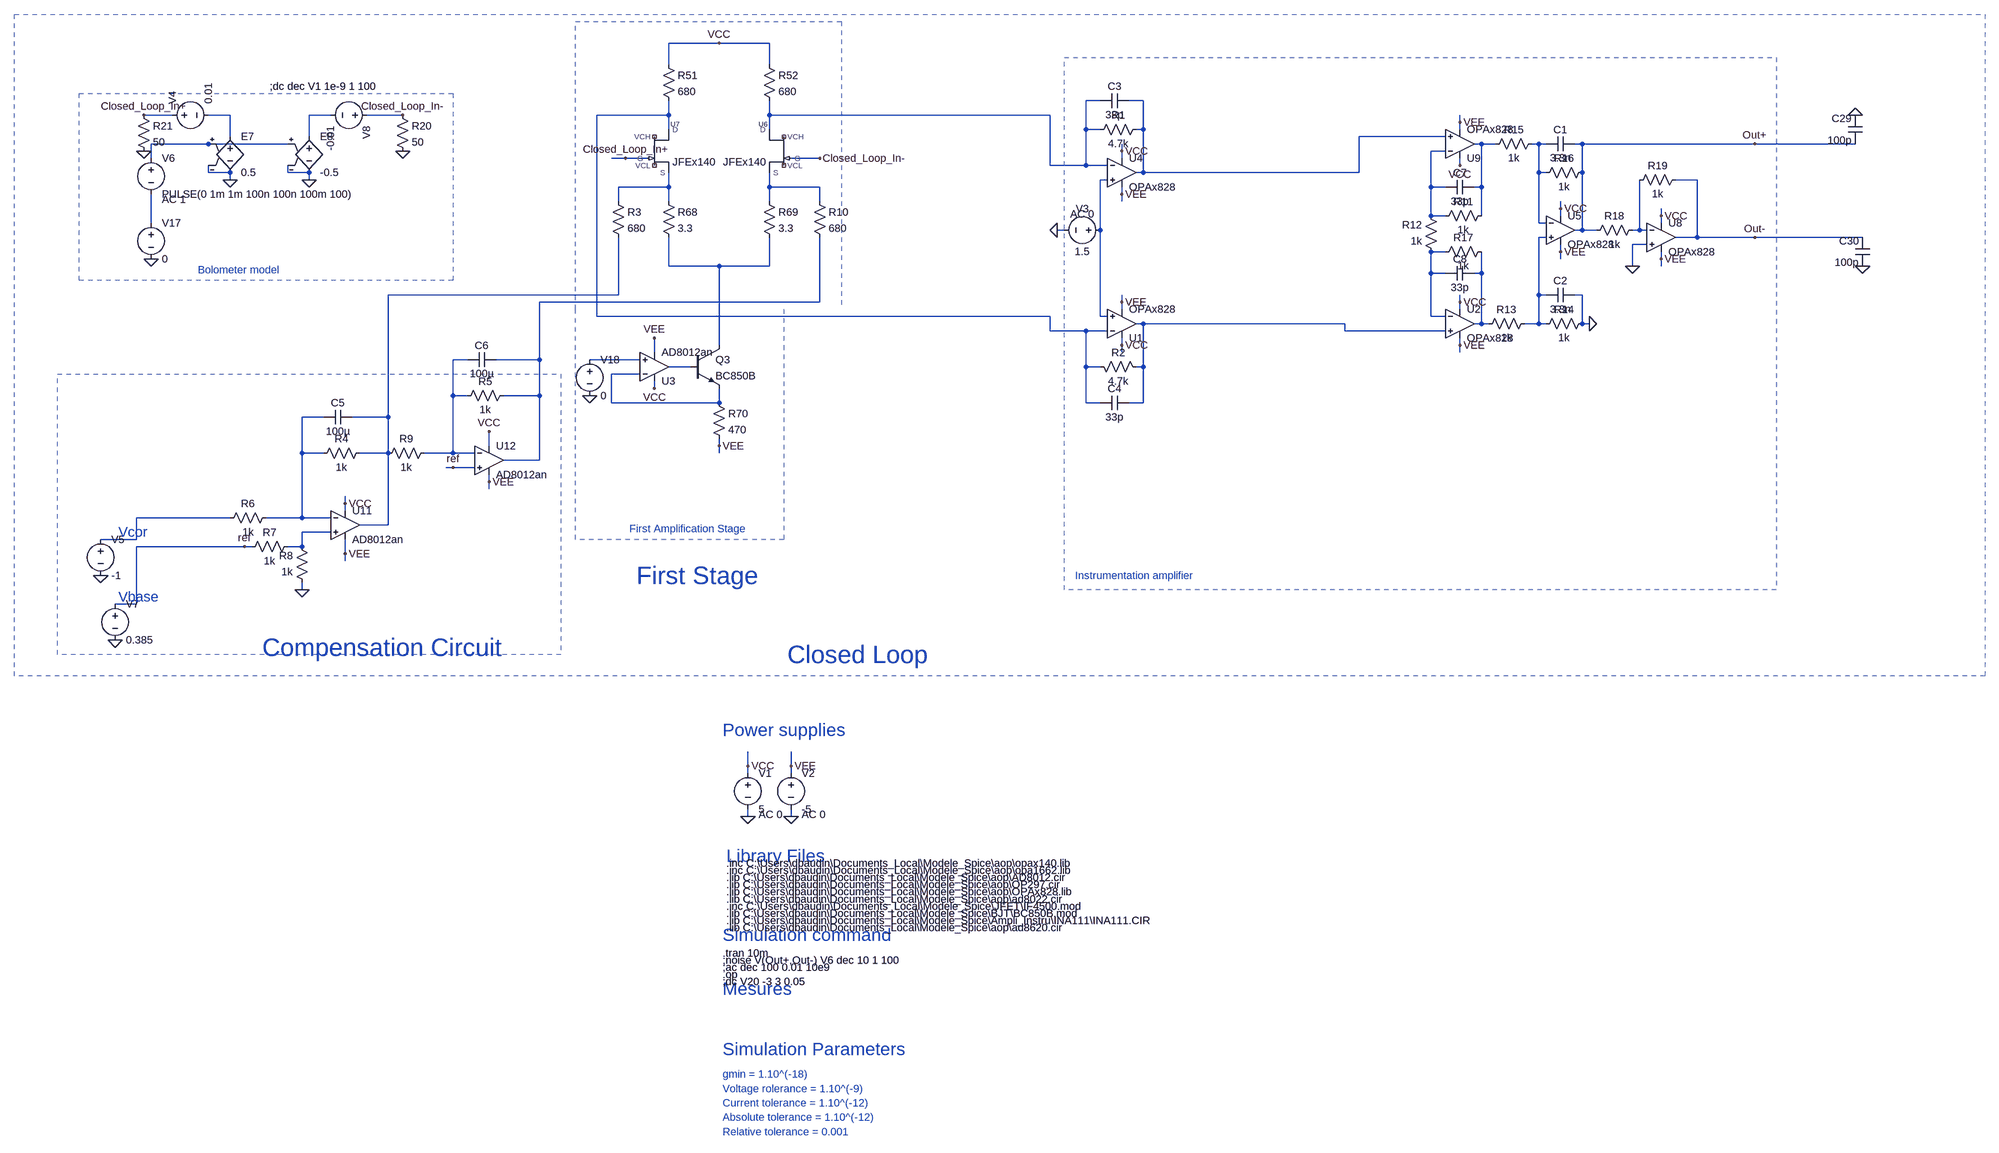
[diagram p0: schematic Board_V3.asc]
Board_V3.asc, the LTspice schematic file:
Version 4
SHEET 1 9396 1576
WIRE -496 -1472 -608 -1472
WIRE -384 -1472 -496 -1472
WIRE -608 -1424 -608 -1472
WIRE -384 -1424 -384 -1472
WIRE 352 -1344 320 -1344
WIRE 448 -1344 416 -1344
WIRE -1712 -1312 -1776 -1312
WIRE -1584 -1312 -1632 -1312
WIRE -1360 -1312 -1408 -1312
WIRE -1200 -1312 -1280 -1312
WIRE -608 -1312 -608 -1344
WIRE -608 -1312 -768 -1312
WIRE -384 -1312 -384 -1344
WIRE 240 -1312 -384 -1312
WIRE 1152 -1296 1152 -1312
WIRE -608 -1280 -608 -1312
WIRE -384 -1280 -384 -1312
WIRE 320 -1280 320 -1344
WIRE 352 -1280 320 -1280
WIRE 448 -1280 448 -1344
WIRE 448 -1280 432 -1280
WIRE 1152 -1280 1152 -1296
WIRE -1584 -1264 -1584 -1312
WIRE -1408 -1264 -1408 -1312
WIRE 1120 -1264 928 -1264
WIRE -1632 -1248 -1760 -1248
WIRE -1456 -1248 -1632 -1248
WIRE 1200 -1248 1184 -1248
WIRE 1232 -1248 1200 -1248
WIRE 1328 -1248 1312 -1248
WIRE 1344 -1248 1328 -1248
WIRE 1424 -1248 1408 -1248
WIRE 1808 -1248 1424 -1248
WIRE 2032 -1248 1808 -1248
WIRE 400 -1232 400 -1248
WIRE 1120 -1232 1088 -1232
WIRE -1760 -1216 -1760 -1248
WIRE -704 -1216 -736 -1216
WIRE -656 -1216 -704 -1216
WIRE -272 -1216 -336 -1216
WIRE 400 -1216 400 -1232
WIRE 240 -1200 240 -1312
WIRE 320 -1200 320 -1280
WIRE 320 -1200 240 -1200
WIRE 368 -1200 320 -1200
WIRE 1152 -1200 1152 -1216
WIRE -1632 -1184 -1632 -1200
WIRE -1584 -1184 -1632 -1184
WIRE -1456 -1184 -1456 -1200
WIRE -1408 -1184 -1456 -1184
WIRE 448 -1184 448 -1280
WIRE 448 -1184 432 -1184
WIRE 928 -1184 928 -1264
WIRE 928 -1184 448 -1184
WIRE 1328 -1184 1328 -1248
WIRE 1344 -1184 1328 -1184
WIRE 1424 -1184 1424 -1248
WIRE -1584 -1168 -1584 -1184
WIRE -1408 -1168 -1408 -1184
WIRE 368 -1168 352 -1168
WIRE 1680 -1168 1632 -1168
WIRE -608 -1152 -608 -1184
WIRE -608 -1152 -720 -1152
WIRE -384 -1152 -384 -1184
WIRE -272 -1152 -384 -1152
WIRE 1088 -1152 1088 -1232
WIRE 1120 -1152 1088 -1152
WIRE 1200 -1152 1200 -1248
WIRE 1200 -1152 1184 -1152
WIRE 400 -1136 400 -1152
WIRE -720 -1120 -720 -1152
WIRE -608 -1120 -608 -1152
WIRE -384 -1120 -384 -1152
WIRE -272 -1120 -272 -1152
WIRE 400 -1120 400 -1136
WIRE 1376 -1104 1376 -1120
WIRE 1088 -1088 1088 -1152
WIRE 1120 -1088 1088 -1088
WIRE 1200 -1088 1200 -1152
WIRE 1376 -1088 1376 -1104
WIRE 1600 -1088 1600 -1104
WIRE -1760 -1072 -1760 -1136
WIRE 1328 -1072 1328 -1184
WIRE 1344 -1072 1328 -1072
WIRE 1600 -1072 1600 -1088
WIRE 272 -1056 256 -1056
WIRE 352 -1056 352 -1168
WIRE 1424 -1056 1424 -1184
WIRE 1424 -1056 1408 -1056
WIRE 1456 -1056 1424 -1056
WIRE 1552 -1056 1552 -1168
WIRE 1552 -1056 1536 -1056
WIRE 1568 -1056 1552 -1056
WIRE 1344 -1040 1328 -1040
WIRE 1680 -1040 1680 -1168
WIRE 1680 -1040 1632 -1040
WIRE 1808 -1040 1680 -1040
WIRE 2048 -1040 1808 -1040
WIRE 1568 -1024 1536 -1024
WIRE 1120 -1008 1088 -1008
WIRE 1376 -1008 1376 -1024
WIRE 1376 -992 1376 -1008
WIRE 1600 -992 1600 -1008
WIRE -608 -976 -608 -1040
WIRE -496 -976 -608 -976
WIRE -384 -976 -384 -1040
WIRE -384 -976 -496 -976
WIRE 1536 -976 1536 -1024
WIRE 1600 -976 1600 -992
WIRE 1088 -960 1088 -1008
WIRE 1120 -960 1088 -960
WIRE 1200 -960 1200 -1008
WIRE 1200 -960 1184 -960
WIRE -720 -912 -720 -1040
WIRE -720 -912 -1232 -912
WIRE 1328 -912 1328 -1040
WIRE 1344 -912 1328 -912
WIRE 1424 -912 1408 -912
WIRE -272 -896 -272 -1040
WIRE -272 -896 -896 -896
WIRE 400 -896 400 -912
WIRE 1152 -896 1152 -912
WIRE 400 -880 400 -896
WIRE 1152 -880 1152 -896
WIRE -768 -864 -768 -1312
WIRE 240 -864 -768 -864
WIRE 352 -864 352 -1056
WIRE 368 -864 352 -864
WIRE 1088 -864 1088 -960
WIRE 1120 -864 1088 -864
WIRE 448 -848 432 -848
WIRE 896 -848 448 -848
WIRE 1200 -848 1200 -960
WIRE 1200 -848 1184 -848
WIRE 1216 -848 1200 -848
WIRE 1328 -848 1328 -912
WIRE 1328 -848 1296 -848
WIRE 1344 -848 1328 -848
WIRE 1424 -848 1424 -912
WIRE 1440 -848 1424 -848
WIRE 240 -832 240 -864
WIRE 320 -832 240 -832
WIRE 368 -832 320 -832
WIRE 896 -832 896 -848
WIRE 1120 -832 896 -832
WIRE -496 -800 -496 -976
WIRE 400 -800 400 -816
WIRE 1152 -800 1152 -816
WIRE -640 -784 -640 -816
WIRE 400 -784 400 -800
WIRE 1152 -784 1152 -800
WIRE -1056 -768 -1088 -768
WIRE -896 -768 -896 -896
WIRE -896 -768 -992 -768
WIRE -672 -768 -784 -768
WIRE -560 -752 -608 -752
WIRE 320 -752 320 -832
WIRE 352 -752 320 -752
WIRE 448 -752 448 -848
WIRE 448 -752 432 -752
WIRE -672 -736 -736 -736
WIRE -640 -704 -640 -720
WIRE -1088 -688 -1088 -768
WIRE -1056 -688 -1088 -688
WIRE -896 -688 -896 -768
WIRE -896 -688 -976 -688
WIRE -736 -672 -736 -736
WIRE -496 -672 -496 -704
WIRE -496 -672 -736 -672
WIRE 320 -672 320 -752
WIRE 352 -672 320 -672
WIRE 448 -672 448 -752
WIRE 448 -672 416 -672
WIRE -1376 -640 -1424 -640
WIRE -1232 -640 -1232 -912
WIRE -1232 -640 -1312 -640
WIRE -1008 -576 -1008 -608
WIRE -496 -576 -496 -592
WIRE -1424 -560 -1424 -640
WIRE -1376 -560 -1424 -560
WIRE -1232 -560 -1232 -640
WIRE -1232 -560 -1296 -560
WIRE -1088 -560 -1088 -688
WIRE -1088 -560 -1152 -560
WIRE -1040 -560 -1088 -560
WIRE -496 -560 -496 -576
WIRE -896 -544 -896 -688
WIRE -896 -544 -976 -544
WIRE -1088 -528 -1104 -528
WIRE -1040 -528 -1088 -528
WIRE -1008 -496 -1008 -512
WIRE -1008 -480 -1008 -496
WIRE -1328 -448 -1328 -464
WIRE -1328 -432 -1328 -448
WIRE -1584 -416 -1792 -416
WIRE -1424 -416 -1424 -560
WIRE -1424 -416 -1504 -416
WIRE -1360 -416 -1424 -416
WIRE -1232 -400 -1232 -560
WIRE -1232 -400 -1296 -400
WIRE -1360 -384 -1424 -384
WIRE -1792 -368 -1792 -416
WIRE -1792 -368 -1872 -368
WIRE -1552 -352 -1792 -352
WIRE -1536 -352 -1552 -352
WIRE -1424 -352 -1424 -384
WIRE -1424 -352 -1456 -352
WIRE -1328 -336 -1328 -368
WIRE -1328 -320 -1328 -336
WIRE -1424 -256 -1424 -272
WIRE -1792 -224 -1792 -352
WIRE -1792 -224 -1840 -224
WIRE -432 656 -432 624
WIRE -336 656 -336 624
WIRE -432 672 -432 656
WIRE -336 672 -336 656
WIRE -432 768 -432 752
WIRE -336 768 -336 752
FLAG -432 768 0
FLAG -336 768 0
FLAG -432 656 VCC
FLAG -336 656 VEE
FLAG -496 -1472 VCC
FLAG -704 -1216 Closed_Loop_In+
FLAG -272 -1216 Closed_Loop_In-
FLAG -1584 -1168 0
FLAG -1408 -1168 0
FLAG -1776 -1312 Closed_Loop_In+
FLAG -1200 -1312 Closed_Loop_In-
FLAG -1760 -992 0
FLAG -640 -816 VEE
FLAG -640 -704 VCC
FLAG -496 -576 VEE
FLAG -784 -688 0
FLAG 2048 -976 0
FLAG 2032 -1312 0
FLAG 400 -1136 VEE
FLAG 400 -1232 VCC
FLAG 256 -1056 0
FLAG 400 -896 VEE
FLAG 400 -800 VCC
FLAG -1328 -448 VCC
FLAG -1328 -336 VEE
FLAG -1088 -528 ref
FLAG -1424 -256 0
FLAG -1552 -352 ref
FLAG -1008 -608 VCC
FLAG -1008 -496 VEE
FLAG -1872 -288 0
FLAG -1840 -144 0
FLAG 1152 -1200 VCC
FLAG 1152 -1296 VEE
FLAG 1152 -896 VCC
FLAG 1152 -800 VEE
FLAG 1376 -1104 VCC
FLAG 1376 -1008 VEE
FLAG 1440 -848 0
FLAG 1600 -1088 VCC
FLAG 1600 -992 VEE
FLAG 1536 -976 0
FLAG 1808 -1248 Out+
FLAG 1808 -1040 Out-
FLAG -1776 -1232 0
FLAG -1200 -1232 0
DATAFLAG -480 -1472 ""
DATAFLAG -560 -976 ""
DATAFLAG -608 -1152 ""
DATAFLAG -384 -1152 ""
DATAFLAG -688 -1216 ""
DATAFLAG -320 -1216 ""
DATAFLAG -384 -1328 ""
DATAFLAG -608 -1328 ""
DATAFLAG -608 -672 ""
DATAFLAG -576 -752 ""
DATAFLAG 1968 -1040 ""
DATAFLAG 1968 -1248 ""
DATAFLAG 320 -1248 ""
DATAFLAG 320 -784 ""
DATAFLAG 448 -1248 ""
DATAFLAG -912 -688 ""
DATAFLAG -1232 -400 ""
DATAFLAG -1072 -528 ""
DATAFLAG -1136 -560 ""
DATAFLAG -1408 -384 ""
DATAFLAG -1488 -416 ""
DATAFLAG -928 -544 ""
DATAFLAG -1616 -416 ""
DATAFLAG -1568 -352 ""
DATAFLAG 1200 -1200 ""
DATAFLAG 1200 -928 ""
DATAFLAG 1328 -896 ""
DATAFLAG 1328 -1136 ""
DATAFLAG 1824 -1248 ""
DATAFLAG 352 -976 ""
DATAFLAG 400 -1232 ""
DATAFLAG 400 -1136 ""
DATAFLAG 480 -848 ""
DATAFLAG -720 -960 ""
DATAFLAG -272 -960 ""
DATAFLAG -720 -768 ""
DATAFLAG -1216 -1312 ""
DATAFLAG -1728 -1312 ""
SYMBOL voltage -432 656 R0
WINDOW 123 24 108 Left 2
WINDOW 39 0 0 Left 0
SYMATTR Value2 AC 0
SYMATTR InstName V1
SYMATTR Value 5
SYMBOL voltage -336 656 R0
WINDOW 123 24 108 Left 2
WINDOW 39 0 0 Left 0
SYMATTR Value2 AC 0
SYMATTR InstName V2
SYMATTR Value -5
SYMBOL res -624 -1440 R0
SYMATTR InstName R51
SYMATTR Value 680
SYMBOL res -400 -1440 R0
SYMATTR InstName R52
SYMATTR Value 680
SYMBOL res -624 -1136 R0
SYMATTR InstName R68
SYMATTR Value 3.3
SYMBOL res -400 -1136 R0
SYMATTR InstName R69
SYMATTR Value 3.3
SYMBOL voltage -1760 -1232 R0
WINDOW 123 24 108 Left 2
WINDOW 39 0 0 Left 0
SYMATTR Value2 AC 1
SYMATTR InstName V6
SYMATTR Value PULSE(0 1m 1m 100n 100n 100m 100)
SYMBOL e -1584 -1280 R0
SYMATTR InstName E7
SYMATTR Value 0.5
SYMBOL e -1408 -1280 R0
SYMATTR InstName E8
SYMATTR Value -0.5
SYMBOL voltage -1760 -1088 R0
WINDOW 123 0 0 Left 0
WINDOW 39 0 0 Left 0
SYMATTR InstName V17
SYMATTR Value 0
SYMBOL res -512 -688 R0
SYMATTR InstName R70
SYMATTR Value 470
SYMBOL npn -560 -800 R0
SYMATTR InstName Q3
SYMATTR Value BC850B
SYMBOL voltage -784 -784 R0
WINDOW 123 0 0 Left 0
WINDOW 39 0 0 Left 0
SYMATTR InstName V18
SYMATTR Value 0
SYMBOL cap 2048 -1248 R180
WINDOW 0 24 56 Left 2
WINDOW 3 24 8 Left 2
SYMATTR InstName C29
SYMATTR Value 100p
SYMBOL cap 2064 -976 R180
WINDOW 0 24 56 Left 2
WINDOW 3 24 8 Left 2
SYMATTR InstName C30
SYMATTR Value 100p
SYMBOL AutoGenerated\\JFEx140 -656 -1280 R0
SYMATTR InstName U7
SYMBOL AutoGenerated\\JFEx140 -336 -1280 M0
SYMATTR InstName U6
SYMBOL res 448 -1296 R90
WINDOW 0 0 56 VBottom 2
WINDOW 3 32 56 VTop 2
SYMATTR InstName R1
SYMATTR Value 4.7k
SYMBOL voltage 368 -1056 R90
WINDOW 0 -32 56 VBottom 2
WINDOW 3 32 56 VTop 2
WINDOW 123 -20 56 VBottom 2
WINDOW 39 0 0 Left 0
SYMATTR InstName V3
SYMATTR Value 1.5
SYMATTR Value2 AC 0
SYMBOL res 448 -736 M270
WINDOW 0 32 56 VTop 2
WINDOW 3 0 56 VBottom 2
SYMATTR InstName R2
SYMATTR Value 4.7k
SYMBOL cap 416 -1360 R90
WINDOW 0 0 32 VBottom 2
WINDOW 3 32 32 VTop 2
SYMATTR InstName C3
SYMATTR Value 33p
SYMBOL cap 416 -688 R90
WINDOW 0 0 32 VBottom 2
WINDOW 3 32 32 VTop 2
SYMATTR InstName C4
SYMATTR Value 33p
SYMBOL res -1280 -576 R90
WINDOW 0 0 56 VBottom 2
WINDOW 3 32 56 VTop 2
SYMATTR InstName R4
SYMATTR Value 1k
SYMBOL res -960 -704 R90
WINDOW 0 0 56 VBottom 2
WINDOW 3 32 56 VTop 2
SYMATTR InstName R5
SYMATTR Value 1k
SYMBOL res -1488 -432 R90
WINDOW 0 0 56 VBottom 2
WINDOW 3 32 56 VTop 2
SYMATTR InstName R6
SYMATTR Value 1k
SYMBOL res -1440 -368 R90
WINDOW 0 0 56 VBottom 2
WINDOW 3 32 56 VTop 2
SYMATTR InstName R7
SYMATTR Value 1k
SYMBOL res -1408 -256 R180
WINDOW 0 36 76 Left 2
WINDOW 3 36 40 Left 2
SYMATTR InstName R8
SYMATTR Value 1k
SYMBOL res -1136 -576 R90
WINDOW 0 0 56 VBottom 2
WINDOW 3 32 56 VTop 2
SYMATTR InstName R9
SYMATTR Value 1k
SYMBOL voltage -1872 -384 R0
WINDOW 123 0 0 Left 0
WINDOW 39 0 0 Left 0
SYMATTR InstName V5
SYMATTR Value -1
SYMBOL voltage -1840 -240 R0
WINDOW 123 0 0 Left 0
WINDOW 39 0 0 Left 0
SYMATTR InstName V7
SYMATTR Value 0.385
SYMBOL res -736 -1136 R0
SYMATTR InstName R3
SYMATTR Value 680
SYMBOL res -288 -1136 R0
SYMATTR InstName R10
SYMATTR Value 680
SYMBOL AutoGenerated\\AD8012an -640 -752 M180
SYMATTR InstName U3
SYMBOL AutoGenerated\\AD8012an -1328 -400 R0
SYMATTR InstName U11
SYMBOL AutoGenerated\\AD8012an -1008 -544 R0
SYMATTR InstName U12
SYMBOL cap -1312 -656 R90
WINDOW 0 0 32 VBottom 2
WINDOW 3 32 32 VTop 2
SYMATTR InstName C5
SYMATTR Value 100µ
SYMBOL cap -992 -784 R90
WINDOW 0 0 32 VBottom 2
WINDOW 3 32 32 VTop 2
SYMATTR InstName C6
SYMATTR Value 100µ
SYMBOL OpAmps\\opamp2 400 -1248 R0
SYMATTR InstName U4
SYMATTR Value OPAx828
SYMBOL OpAmps\\opamp2 400 -784 M180
SYMATTR InstName U1
SYMATTR Value OPAx828
SYMBOL res 1216 -1104 R90
WINDOW 0 0 56 VBottom 2
WINDOW 3 32 56 VTop 2
SYMATTR InstName R11
SYMATTR Value 1k
SYMBOL res 1104 -992 R180
WINDOW 0 36 76 Left 2
WINDOW 3 36 40 Left 2
SYMATTR InstName R12
SYMATTR Value 1k
SYMBOL res 1312 -864 R90
WINDOW 0 0 56 VBottom 2
WINDOW 3 32 56 VTop 2
SYMATTR InstName R13
SYMATTR Value 1k
SYMBOL res 1440 -864 R90
WINDOW 0 0 56 VBottom 2
WINDOW 3 32 56 VTop 2
SYMATTR InstName R14
SYMATTR Value 1k
SYMBOL res 1328 -1264 R90
WINDOW 0 0 56 VBottom 2
WINDOW 3 32 56 VTop 2
SYMATTR InstName R15
SYMATTR Value 1k
SYMBOL res 1440 -1200 R90
WINDOW 0 0 56 VBottom 2
WINDOW 3 32 56 VTop 2
SYMATTR InstName R16
SYMATTR Value 1k
SYMBOL res 1216 -1024 R90
WINDOW 0 0 56 VBottom 2
WINDOW 3 32 56 VTop 2
SYMATTR InstName R17
SYMATTR Value 1k
SYMBOL res 1552 -1072 R90
WINDOW 0 0 56 VBottom 2
WINDOW 3 32 56 VTop 2
SYMATTR InstName R18
SYMATTR Value 1k
SYMBOL res 1648 -1184 R90
WINDOW 0 0 56 VBottom 2
WINDOW 3 32 56 VTop 2
SYMATTR InstName R19
SYMATTR Value 1k
SYMBOL cap 1408 -1264 R90
WINDOW 0 0 32 VBottom 2
WINDOW 3 32 32 VTop 2
SYMATTR InstName C1
SYMATTR Value 3.3n
SYMBOL cap 1408 -928 R90
WINDOW 0 0 32 VBottom 2
WINDOW 3 32 32 VTop 2
SYMATTR InstName C2
SYMATTR Value 3.3n
SYMBOL OpAmps\\opamp2 1152 -912 R0
SYMATTR InstName U2
SYMATTR Value OPAx828
SYMBOL OpAmps\\opamp2 1376 -1120 R0
SYMATTR InstName U5
SYMATTR Value OPAx828
SYMBOL OpAmps\\opamp2 1600 -1104 R0
SYMATTR InstName U8
SYMATTR Value OPAx828
SYMBOL OpAmps\\opamp2 1152 -1184 M180
SYMATTR InstName U9
SYMATTR Value OPAx828
SYMBOL cap 1184 -1168 R90
WINDOW 0 0 32 VBottom 2
WINDOW 3 32 32 VTop 2
SYMATTR InstName C7
SYMATTR Value 33p
SYMBOL cap 1184 -976 R90
WINDOW 0 0 32 VBottom 2
WINDOW 3 32 32 VTop 2
SYMATTR InstName C8
SYMATTR Value 33p
SYMBOL res -1216 -1328 R0
SYMATTR InstName R20
SYMATTR Value 50
SYMBOL res -1792 -1328 R0
SYMATTR InstName R21
SYMATTR Value 50
SYMBOL voltage -1728 -1312 R270
WINDOW 123 24 108 Left 2
WINDOW 39 0 0 Left 0
SYMATTR InstName V4
SYMATTR Value 0.01
SYMBOL voltage -1264 -1312 R90
WINDOW 123 24 108 Left 2
WINDOW 39 0 0 Left 0
SYMATTR InstName V8
SYMATTR Value -0.01
TEXT -480 856 Left 4 ;Library Files
TEXT -488 1032 Left 4 ;Simulation command
TEXT -488 576 Left 4 ;Power supplies
TEXT -488 1152 Left 4 ;Mesures
TEXT -480 968 Left 2 !.inc C:\\Users\\dbaudin\\Documents_Local\\Modele_Spice\\JFET\\IF4500.mod
TEXT -488 1384 Left 4 ;Simulation Parameters
TEXT -488 1440 Left 2 ;gmin = 1.10^(-18)
TEXT -488 1472 Left 2 ;Voltage rolerance = 1.10^(-9)
TEXT -488 1504 Left 2 ;Current tolerance = 1.10^(-12)
TEXT -488 1536 Left 2 ;Absolute tolerance = 1.10^(-12)
TEXT -488 1568 Left 2 ;Relative tolerance = 0.001
TEXT -488 1088 Left 2 !;noise V(Out+,Out-) V6 dec 10 1 100
TEXT -480 952 Left 2 !.lib C:\\Users\\dbaudin\\Documents_Local\\Modele_Spice\\aop\\ad8022.cir
TEXT -480 936 Left 2 !.lib C:\\Users\\dbaudin\\Documents_Local\\Modele_Spice\\aop\\OPAx828.lib
TEXT -488 1072 Left 2 !.tran 10m
TEXT -480 984 Left 2 !.lib C:\\Users\\dbaudin\\Documents_Local\\Modele_Spice\\BJT\\BC850B.mod
TEXT -488 1104 Left 2 !;ac dec 100 0.01 10e9
TEXT -480 1000 Left 2 !.lib C:\\Users\\dbaudin\\Documents_Local\\Modele_Spice\\Ampli_Instru\\INA111\\INA111.CIR
TEXT -488 1136 Left 2 !;dc V20 -3 3 0.05
TEXT -480 1016 Left 2 !.lib C:\\Users\\dbaudin\\Documents_Local\\Modele_Spice\\aop\\ad8620.cir
TEXT -488 1120 Left 2 !.op
TEXT -344 -112 Left 5 ;Closed Loop
TEXT -1656 -968 Left 2 ;Bolometer model
TEXT -696 -392 Left 2 ;First Amplification Stage
TEXT -680 -288 Left 5 ;First Stage
TEXT -1496 -1376 Left 2 !;dc dec V1 1e-9 1 100
TEXT 296 -288 Left 2 ;Instrumentation amplifier
TEXT -480 920 Left 2 !.lib C:\\Users\\dbaudin\\Documents_Local\\Modele_Spice\\aop\\OP297.cir
TEXT -480 904 Left 2 !.lib C:\\Users\\dbaudin\\Documents_Local\\Modele_Spice\\aop\\AD8012.cir
TEXT -480 888 Left 2 !.inc C:\\Users\\dbaudin\\Documents_Local\\Modele_Spice\\aop\\opa1662.lib
TEXT -1512 -128 Left 5 ;Compensation Circuit
TEXT -1832 -384 Left 3 ;Vcor
TEXT -1832 -240 Left 3 ;Vbase
TEXT -480 872 Left 2 !.inc C:\\Users\\dbaudin\\Documents_Local\\Modele_Spice\\aop\\opax140.lib
LINE Normal -816 -880 -816 -1520 2
LINE Normal -816 -368 -816 -880 2
LINE Normal -352 -880 -352 -368 2
LINE Normal -224 -1520 -224 -880 2
LINE Normal -816 -1520 -224 -1520 2
LINE Normal -816 -1520 -816 -1520 2
LINE Normal -352 -368 -816 -368 2
RECTANGLE Normal 2320 -64 -2064 -1536 2
RECTANGLE Normal -1088 -944 -1920 -1360 2
RECTANGLE Normal 1856 -256 272 -1440 2
RECTANGLE Normal -848 -112 -1968 -736 2

The netlist it stands for:
* Board_V3.asc
V1 VCC 0 5 AC 0
V2 VEE 0 -5 AC 0
R51 VCC N005 680
R52 VCC N001 680
R68 N011 N017 3.3
R69 N012 N017 3.3
V6 N006 N013 PULSE(0 1m 1m 100n 100n 100m 100) AC 1
E7 N003 0 N006 0 0.5
E8 N004 0 N006 0 -0.5
V17 N013 0 0
R70 N025 VEE 470
Q3 N017 N024 N025 0 BC850B
V18 N023 0 0
C29 Out+ 0 100p
C30 0 Out- 100p
XU7 N005 Closed_Loop_In+ N011 NC_01 NC_02 JFEx140  ; pins D G S VCH VCL
XU6 N001 Closed_Loop_In- N012 NC_03 NC_04 JFEx140  ; pins D G S VCH VCL
R1 N002 N001 4.7k
V3 N010 0 1.5 AC 0
R2 N021 N005 4.7k
C3 N002 N001 33p
C4 N021 N005 33p
R4 N019 N026 1k
R5 N020 N022 1k
R6 N026 N027 1k
R7 N028 ref 1k
R8 0 N028 1k
R9 N022 N019 1k
V5 N027 0 -1
V7 ref 0 0.385
R3 N011 N019 680
R10 N012 N020 680
* U3: AD8012an (symbol AutoGenerated\AD8012an not available, pins judged from their places): In+=N023 In-=N025 V+=VCC V-=VEE OUT=N024
* U11: AD8012an (symbol AutoGenerated\AD8012an not available, pins judged from their places): In+=N028 In-=N026 V+=VCC V-=VEE OUT=N019
* U12: AD8012an (symbol AutoGenerated\AD8012an not available, pins judged from their places): In+=ref In-=N022 V+=VCC V-=VEE OUT=N020
C5 N019 N026 100µ
C6 N020 N022 100µ
XU4 N010 N001 VCC VEE N002 OPAx828  ; pins In+ In- V+ V- OUT
XU1 N010 N005 VCC VEE N021 OPAx828  ; pins In+ In- V+ V- OUT
R11 N007 N009 1k
R12 N016 N009 1k
R13 N015 N018 1k
R14 0 N015 1k
R15 N008 N007 1k
R16 Out+ N008 1k
R17 N018 N016 1k
R18 N014 Out+ 1k
R19 Out- N014 1k
C1 Out+ N008 3.3n
C2 0 N015 3.3n
XU2 N021 N016 VCC VEE N018 OPAx828  ; pins In+ In- V+ V- OUT
XU5 N015 N008 VCC VEE Out+ OPAx828  ; pins In+ In- V+ V- OUT
XU8 0 N014 VCC VEE Out- OPAx828  ; pins In+ In- V+ V- OUT
XU9 N002 N009 VCC VEE N007 OPAx828  ; pins In+ In- V+ V- OUT
C7 N007 N009 33p
C8 N018 N016 33p
R20 Closed_Loop_In- 0 50
R21 Closed_Loop_In+ 0 50
V4 Closed_Loop_In+ N003 0.01
V8 Closed_Loop_In- N004 -0.01
.model NPN NPN
.model PNP PNP
.lib standard.bjt
* Library Files
* Simulation command
* Power supplies
* Mesures
.inc C:\Users\dbaudin\Documents_Local\Modele_Spice\JFET\IF4500.mod
* Simulation Parameters
* gmin = 1.10^(-18)
* Voltage rolerance = 1.10^(-9)
* Current tolerance = 1.10^(-12)
* Absolute tolerance = 1.10^(-12)
* Relative tolerance = 0.001
;noise V(Out+,Out-) V6 dec 10 1 100
.lib C:\Users\dbaudin\Documents_Local\Modele_Spice\aop\ad8022.cir
.lib C:\Users\dbaudin\Documents_Local\Modele_Spice\aop\OPAx828.lib
.tran 10m
.lib C:\Users\dbaudin\Documents_Local\Modele_Spice\BJT\BC850B.mod
;ac dec 100 0.01 10e9
.lib C:\Users\dbaudin\Documents_Local\Modele_Spice\Ampli_Instru\INA111\INA111.CIR
;dc V20 -3 3 0.05
.lib C:\Users\dbaudin\Documents_Local\Modele_Spice\aop\ad8620.cir
.op
* Closed Loop
* Bolometer model
* First Amplification Stage
* First Stage
;dc dec V1 1e-9 1 100
* Instrumentation amplifier
.lib C:\Users\dbaudin\Documents_Local\Modele_Spice\aop\OP297.cir
.lib C:\Users\dbaudin\Documents_Local\Modele_Spice\aop\AD8012.cir
.inc C:\Users\dbaudin\Documents_Local\Modele_Spice\aop\opa1662.lib
* Compensation Circuit
* Vcor
* Vbase
.inc C:\Users\dbaudin\Documents_Local\Modele_Spice\aop\opax140.lib
.lib C:\Users\dbaudin\Documents_Local\Modele_Spice\JFET\jfex140.lib
.backanno
.end